# EAGLE design mc-v1-sch (EAGLE 9.2.2)
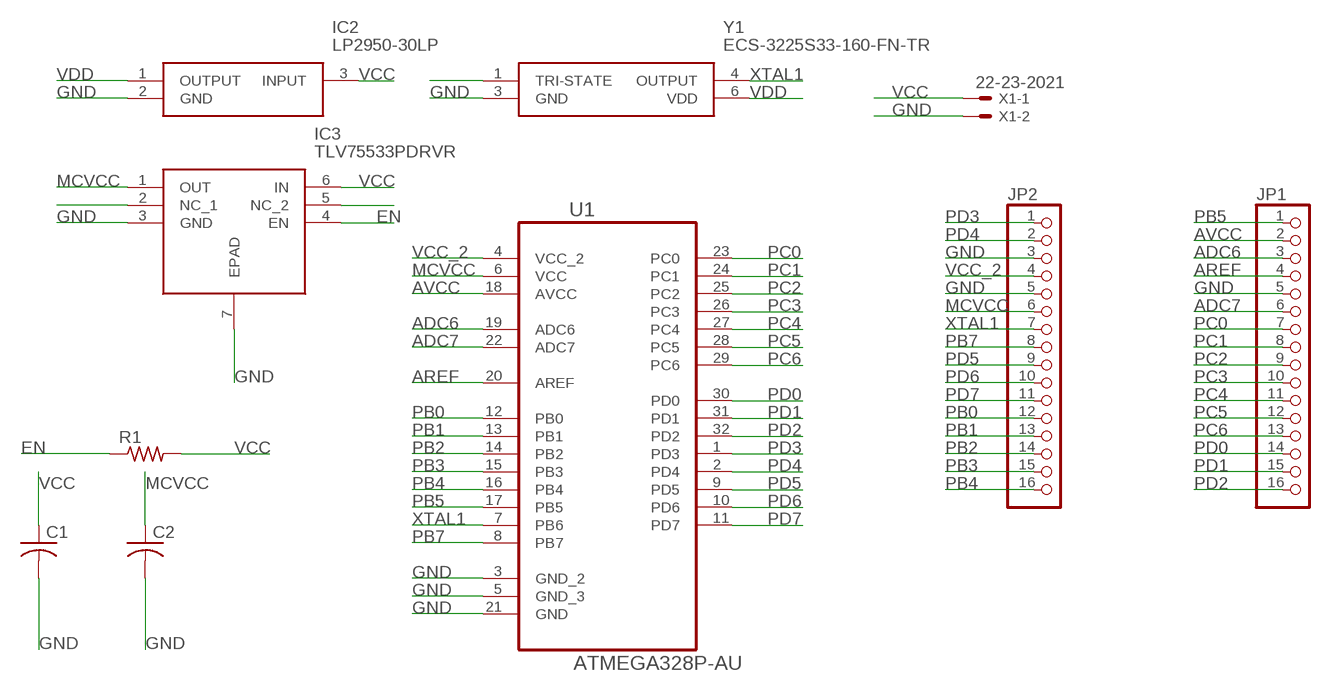
[diagram p0: schematic, sheet 1]

## Parts
C1  C-USC1206  [C1206]
C2  C-USC1206  [C1206]
IC2  LP2950-30LP  [LP0003A]
IC3  TLV75533PDRVR  [SON65P200X200X80-7N]
JP1  PINHD-1X16  [1X16]
JP2  PINHD-1X16  [1X16]
R1  R-US_R0603  [R0603]
U1  ATMEGA328P-AU  [QFP80P900X900X120-32N]
X1  22-23-2021  [22-23-2021]
Y1  ECS-3225S33-160-FN-TR  [ECS3225S33200FNTR]

## Nets
ADC6: JP1.3 U1.19(ADC6)
ADC7: JP1.6 U1.22(ADC7)
AREF: JP1.4 U1.20(AREF)
AVCC: JP1.2 U1.18(AVCC)
EN: IC3.4(EN) R1.1
GND: C1.2 C2.2 IC2.2(GND) IC3.3(GND) IC3.7(EPAD) JP1.5 JP2.3 JP2.5 U1.3(GND_2) U1.5(GND_3) U1.21(GND) X1.2 Y1.3(GND)
MCVCC: C2.1 IC3.1(OUT) JP2.6 U1.6(VCC)
N$1: Y1.1(TRI-STATE)
N$5: IC3.2(NC_1)
N$8: IC3.5(NC_2)
PB0: JP2.12 U1.12(PB0)
PB1: JP2.13 U1.13(PB1)
PB2: JP2.14 U1.14(PB2)
PB3: JP2.15 U1.15(PB3)
PB4: JP2.16 U1.16(PB4)
PB5: JP1.1 U1.17(PB5)
PB7: JP2.8 U1.8(PB7)
PC0: JP1.7 U1.23(PC0)
PC1: JP1.8 U1.24(PC1)
PC2: JP1.9 U1.25(PC2)
PC3: JP1.10 U1.26(PC3)
PC4: JP1.11 U1.27(PC4)
PC5: JP1.12 U1.28(PC5)
PC6: JP1.13 U1.29(PC6)
PD0: JP1.14 U1.30(PD0)
PD1: JP1.15 U1.31(PD1)
PD2: JP1.16 U1.32(PD2)
PD3: JP2.1 U1.1(PD3)
PD4: JP2.2 U1.2(PD4)
PD5: JP2.9 U1.9(PD5)
PD6: JP2.10 U1.10(PD6)
PD7: JP2.11 U1.11(PD7)
VCC: C1.1 IC2.3(INPUT) IC3.6(IN) R1.2 X1.1
VCC_2: JP2.4 U1.4(VCC_2)
VDD: IC2.1(OUTPUT) Y1.6(VDD)
XTAL1: JP2.7 U1.7(PB6) Y1.4(OUTPUT)

## Library data of the parts
C1 C2 = rcl:C-US: CAPACITOR, American symbol; SPICEPREFIX: C
IC2 = LP2950-30LP:LP2950-30LP: Adjustable Micropower Voltage Regulator With Shutdown Source: Datasheet <http://www.ti.com/lit/gpn/LP2950>; DESCRIPTION: Adjustable Micropower Voltage Regulator With Shutdown; HEIGHT: mm; MANUFACTURER_NAME: Texas Instruments; MANUFACTURER_PART_NUMBER: LP2950-30LP; MOUSER_PART_NUMBER: 595-LP2950-30LP; MOUSER_PRICE-STOCK: https://www.mouser.com/Search/Refine.aspx?Keyword=595-LP2950-30LP; RS_PART_NUMBER: 7620437; RS_PRICE-STOCK: https://uk.rs-online.com/web/p/products/7620437
IC3 = TLV75533PDRVR:TLV75533PDRVR: 500-mA low-IQ small-size low-dropout (LDO) regulator Source: Datasheet <http://www.ti.com/lit/gpn/tlv755p>; DESCRIPTION: 500-mA low-IQ small-size low-dropout (LDO) regulator; HEIGHT: 0.8mm; MANUFACTURER_NAME: Texas Instruments; MANUFACTURER_PART_NUMBER: TLV75533PDRVR; MOUSER_PART_NUMBER: 595-TLV75533PDRVR; MOUSER_PRICE-STOCK: https://www.mouser.com/Search/Refine.aspx?Keyword=595-TLV75533PDRVR
JP1 JP2 = pinhead:PINHD-1X16: PIN HEADER
R1 = rcl:R-US_: RESISTOR, American symbol; SPICEPREFIX: R
U1 = Atmel_By_element14_Batch_1-00:ATMEGA328P-AU: 8-bit Microcontroller with In-System Programmable Flash; MPN: ATMEGA328P-AU; OC_FARNELL: 1715486; OC_NEWARK: 14R4631; PACKAGE: TQFP-32; SUPPLIER: Atmel
X1 = con-molex:22-23-2021: .100" (2.54mm) Center Header - 2 Pin; MF: MOLEX; MPN: 22-23-2021; OC_FARNELL: 1462926; OC_NEWARK: 25C3832
Y1 = ECS-3225S33-160-FN-TR:ECS-3225S33-160-FN-TR: Standard Clock Oscillators 16MHz 3.3V 10ppm -40C +85C Source: Datasheet <https://ecsxtal.com/store/pdf/ECS-3225S.pdf>; DESCRIPTION: Standard Clock Oscillators 16MHz 3.3V 10ppm -40C +85C; HEIGHT: 1mm; MANUFACTURER_NAME: ECS; MANUFACTURER_PART_NUMBER: ECS-3225S33-160-FN-TR; MOUSER_PART_NUMBER: 520-3225S33-160-FNT; MOUSER_PRICE-STOCK: https://www.mouser.com/Search/Refine.aspx?Keyword=520-3225S33-160-FNT

## Board
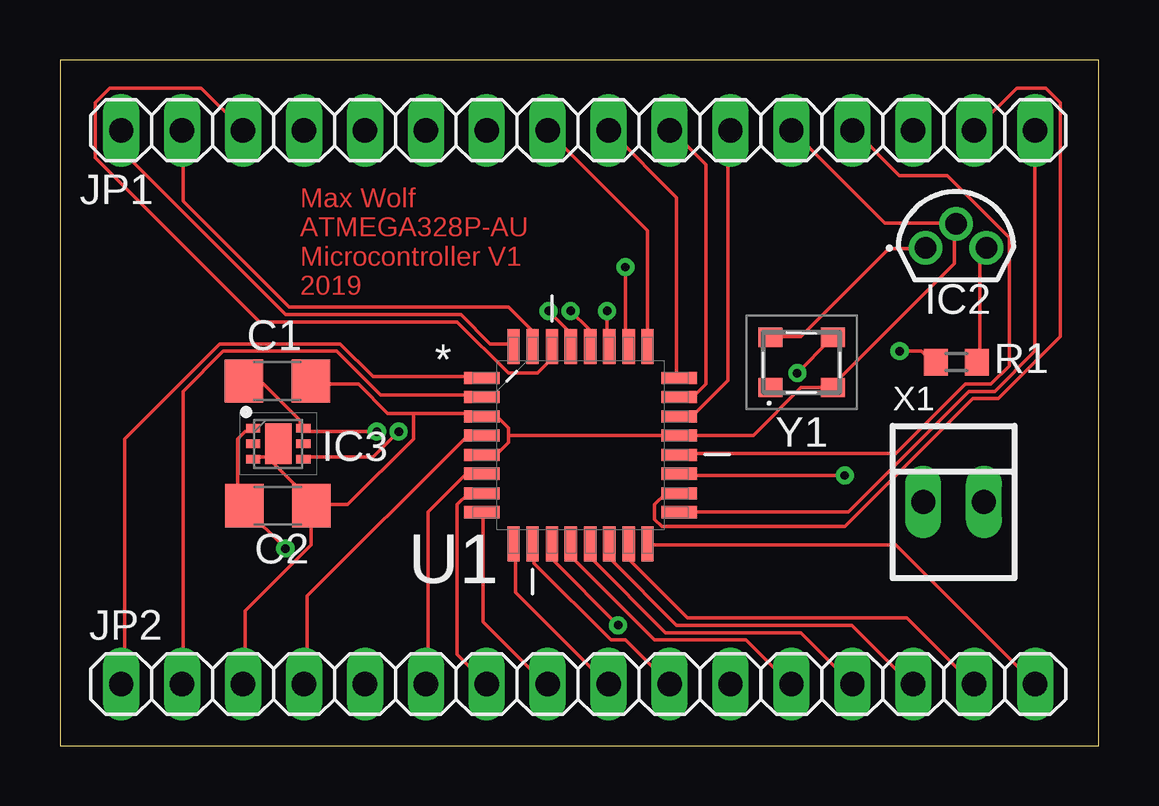
[diagram p1: board, top side]
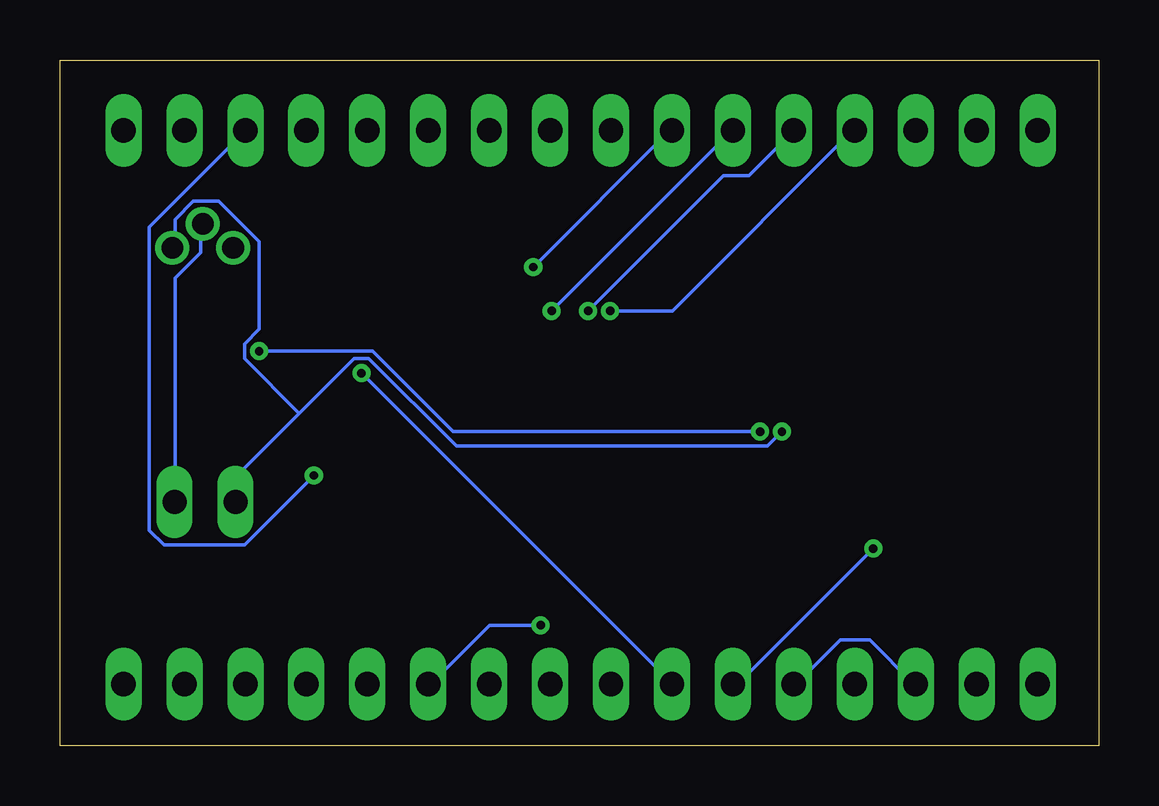
[diagram p2: board, bottom side, seen from below]

Size 43.3 x 28.6 mm. Coordinates in mm from the lower left corner, seen from the top.
Outline: 0,0 43.3,0 43.3,28.6 0,28.6 0,0
Copper layers (1*16): Top 0.035mm / dielectric 1.5mm / Bottom 0.035mm
Design rules "default": minimum track width 6mil, minimum drill 0.35mm, track to track 6mil, track to pad 6mil, pad to pad 6mil, via to via 6mil, smd to smd 6mil, copper to edge 40mil, drill to drill 6mil, minimum pad ring 10mil, minimum via ring 8mil, stop-mask expansion 4mil, vias tented up to drill 0mil, thermal gap 10mil

### Footprints (pad centres in the part's own frame; a part is rotated, then mirrored left to right if it is on the bottom)
C1206 = smd 1.6 x 1.8: 1 -1.4,0; 2 1.4,0
LP0003A = drill 0.9 pad 1.4: 1 -1.27,-1; 2 0,0; 3 1.27,-1
SON65P200X200X80-7N = smd 0.6 x 0.35: 1 -1.05,0.65; 2 -1.05,0; 3 -1.05,-0.65; 4 1.05,-0.65; 5 1.05,0; 6 1.05,0.65 | smd 1.1 x 1.7: 7 0,0
1X16 = drill 1.016 long: 1 -19.05,0; 2 -16.51,0; 3 -13.97,0; 4 -11.43,0; 5 -8.89,0; 6 -6.35,0; 7 -3.81,0; 8 -1.27,0; 9 1.27,0; 10 3.81,0; 11 6.35,0; 12 8.89,0; 13 11.43,0; 14 13.97,0; 15 16.51,0; 16 19.05,0
R0603 = smd 1 x 1.1: 1 -0.85,0; 2 0.85,0
QFP80P900X900X120-32N = smd 1.473 x 0.508: 1 -4.115,2.794; 2 -4.115,2.007; 3 -4.115,1.194; 4 -4.115,0.406; 5 -4.115,-0.406; 6 -4.115,-1.194; 7 -4.115,-2.007; 8 -4.115,-2.794; 17 4.115,-2.794; 18 4.115,-2.007; 19 4.115,-1.194; 20 4.115,-0.406; 21 4.115,0.406; 22 4.115,1.194; 23 4.115,2.007; 24 4.115,2.794 | smd 0.508 x 1.473: 9 -2.794,-4.115; 10 -2.007,-4.115; 11 -1.194,-4.115; 12 -0.406,-4.115; 13 0.406,-4.115; 14 1.194,-4.115; 15 2.007,-4.115; 16 2.794,-4.115; 25 2.794,4.115; 26 2.007,4.115; 27 1.194,4.115; 28 0.406,4.115; 29 -0.406,4.115; 30 -1.194,4.115; 31 -2.007,4.115; 32 -2.794,4.115
22-23-2021 = drill 1 long: 1 -1.27,0; 2 1.27,0
ECS3225S33200FNTR = smd 1 x 0.8: 1 -1.3,-1.05; 3 1.3,-1.05; 4 1.3,1.05; 6 -1.3,1.05

### Placement (x,y rotation side)
C1  9.06,15.22 0 top
C2  9.08,10.02 0 top
IC2  37.35,21.77 0 top
IC3  9.1,12.6 0 top
JP1  21.6,25.67 180 top
JP2  21.6,2.58 0 top
R1  37.36,16 0 top
U1  21.7,12.54 0 top
X1  37.25,10.17 0 top
Y1  30.91,15.99 0 top

### Tracks (layer width: path | path; a pad name or v marks a point on that pad's centre or on a via)
ADC6  (via drill 0.35)
  Top 0.152: v32.71,11.28 25.86,11.28 U1.19
  Bottom 0.152: v32.71,11.28 35.61,8.38 38.96,8.38 39.57,8.99 39.57,21.64 35.61,25.6 JP1.3
ADC7
  Top 0.152: U1.22 25.86,13.87 26.46,13.87 27.84,15.24 27.84,25.6 JP1.6
AREF
  Top 0.152: U1.20 25.86,12.19 34.85,12.19 37.74,15.09 38.81,15.09 39.57,15.85 39.57,21.18 36.98,23.77 35,23.77 33.17,25.6 JP1.4
AVCC
  Top 0.152: U1.18 25.7,10.52 25.25,10.52 24.79,10.06 24.79,9.45 25.09,9.14 32.71,9.14 38.05,14.48 39.11,14.48 41.7,17.07 41.7,26.82 41.1,27.43 39.88,27.43 38.2,25.76 JP1.2
EN  (via drill 0.35)
  Top 0.152: v14.12,13.11 13.05,12.04 10.16,12.04 IC3.4 | v35,16.46 35.91,16.46 36.37,16 R1.1
  Bottom 0.152: v14.12,13.11 26.92,13.11 30.28,16.46 v35,16.46
GND
  Top 0.152: JP1.5 30.58,25.6 34.39,21.79 37.29,21.79 IC2.2 37.29,21.64 37.29,20.12 32.26,15.09 Y1.3 32.1,14.94 30.89,14.94 28.9,12.95 25.86,12.95 U1.21 25.7,12.95 18.69,12.95 | 8.63,12.04 8.18,12.04 IC3.3 | 8.63,12.04 9.09,12.5 IC3.7 8.63,12.04 | 10.62,10.06 8.63,12.04 | 18.69,12.95 18.69,13.26 18.24,13.72 17.63,13.72 U1.3 17.47,13.87 14.73,13.87 | 18.69,12.95 18.69,12.65 18.24,12.19 17.63,12.19 U1.5 | 14.73,13.87 13.66,13.87 12.44,15.09 10.46,15.09 C1.2 | 10.62,10.06 11.99,10.06 14.73,12.8 14.73,13.87 | 10.62,10.06 C2.2 10.46,9.91 10.46,8.38 7.72,5.64 7.72,2.59 JP2.3
  Bottom 0.152: X1.2 38.51,10.21 38.51,19.51 37.44,20.57 37.44,21.64 IC2.2 | JP2.3 7.72,2.59 9.55,4.42 10.77,4.42 12.6,2.59 JP2.5
MCVCC  (via drill 0.35)
  Top 0.152: IC3.1 8.03,13.11 7.72,13.11 7.42,12.8 7.42,10.21 7.57,10.06 C2.1 7.72,9.91 v9.4,8.23 | U1.6 17.47,11.28 16.86,11.28 15.34,9.75 15.34,2.59 JP2.6
  Bottom 0.152: v9.4,8.23 15.19,2.44 JP2.6
PB0
  Top 0.152: U1.12 21.44,8.38 21.44,7.77 24.79,4.42 28.6,4.42 30.43,2.59 JP2.12
PB1
  Top 0.152: U1.13 22.2,8.38 22.2,7.77 25.25,4.72 30.89,4.72 33.02,2.59 JP2.13
PB2
  Top 0.152: U1.14 22.96,8.38 22.96,7.77 25.7,5.03 33.02,5.03 35.46,2.59 JP2.14
PB3
  Top 0.152: U1.15 23.72,8.38 23.72,7.77 26.16,5.33 35.3,5.33 38.05,2.59 JP2.15
PB4
  Top 0.152: U1.16 24.64,8.38 34.85,8.38 40.64,2.59 JP2.16
PB5
  Top 0.152: U1.17 25.86,9.75 32.87,9.75 37.9,14.78 38.96,14.78 40.64,16.46 40.64,25.6 JP1.1
PB7
  Top 0.152: U1.8 17.63,9.6 17.63,5.18 20.22,2.59 JP2.8
PC0
  Top 0.152: U1.23 25.86,14.63 26.46,14.63 26.92,15.09 26.92,24.23 25.55,25.6 JP1.7
PC1
  Top 0.152: U1.24 25.7,15.39 25.7,22.86 22.96,25.6 JP1.8
PC2
  Top 0.152: U1.25 24.48,16.76 24.48,21.49 20.37,25.6 JP1.9
PC3  (via drill 0.35)
  Top 0.152: v23.57,19.96 23.57,16.76 U1.26
  Bottom 0.152: v23.57,19.96 17.93,25.6 JP1.10
PC4  (via drill 0.35)
  Top 0.152: v22.81,18.14 22.81,16.76 U1.27
  Bottom 0.152: v22.81,18.14 15.34,25.6 JP1.11
PC5  (via drill 0.35)
  Top 0.152: v21.28,18.14 22.05,17.37 22.05,16.76 U1.28
  Bottom 0.152: v21.28,18.14 15.64,23.77 14.58,23.77 12.75,25.6 JP1.12
PC6  (via drill 0.35)
  Top 0.152: v20.37,18.14 21.28,17.22 21.28,16.76 U1.29
  Bottom 0.152: v20.37,18.14 17.78,18.14 10.31,25.6 JP1.13
PD0
  Top 0.152: U1.30 20.37,16.61 20.37,16 19.91,15.54 18.69,15.54 16.56,17.68 8.33,17.68 1.47,24.54 1.47,26.82 2.08,27.43 5.89,27.43 7.57,25.76 JP1.14
PD1
  Top 0.152: U1.31 19.61,16.76 19.61,17.37 18.69,18.29 9.55,18.29 5.13,22.71 5.13,25.6 JP1.15
PD2
  Top 0.152: U1.32 18.85,16.76 17.93,16.76 16.71,17.98 9.4,17.98 2.69,24.69 2.69,25.6 JP1.16
PD3
  Top 0.152: U1.1 17.47,15.39 13.05,15.39 11.68,16.76 6.65,16.76 2.69,12.8 2.69,2.59 JP2.1
PD4
  Top 0.152: U1.2 17.47,14.63 13.36,14.63 11.53,16.46 6.81,16.46 5.13,14.78 5.13,2.59 JP2.2
PD5
  Top 0.152: U1.9 19,8.38 19,6.4 22.81,2.59 JP2.9
PD6
  Top 0.152: U1.10 19.76,8.38 19.76,7.62 22.96,4.42 23.57,4.42 25.4,2.59 JP2.10
PD7  (via drill 0.35)
  Top 0.152: v23.27,5.03 20.52,7.77 20.52,8.38 U1.11
  Bottom 0.152: v23.27,5.03 25.4,5.03 27.84,2.59 JP2.11
VCC  (via drill 0.35)
  Top 0.152: R1.2 38.35,16 38.35,20.57 38.51,20.73 IC2.3 | C1.1 7.72,15.09 8.48,15.09 10.01,13.56 10.01,13.26 IC3.6 10.16,13.11 v13.21,13.11
  Bottom 0.152: v13.21,13.11 13.82,12.5 26.77,12.5 30.43,16.15 31.04,16.15 33.32,13.87 | 33.32,13.87 35.91,11.28 35.91,10.21 X1.1 | 33.32,13.87 35.61,16.15 35.61,16.76 35,17.37 35,21.03 36.68,22.71 37.74,22.71 38.51,21.95 38.51,20.88 IC2.3
VCC_2
  Top 0.152: U1.4 17.47,12.8 16.86,12.8 10.31,6.25 10.31,2.59 JP2.4
VDD
  Top 0.152: Y1.6 29.67,17.07 30.89,17.07 34.54,20.73 36.07,20.73 IC2.1
XTAL1  (via drill 0.35)
  Top 0.152: v30.73,15.54 32.1,16.92 Y1.4 | U1.7 17.47,10.52 17.02,10.52 16.56,10.06 16.56,3.81 17.78,2.59 JP2.7
  Bottom 0.152: v30.73,15.54 17.78,2.59 JP2.7

### Text on the board
Top: Max Wolf / ATMEGA328P-AU / Microcontroller V1 / 2019